# Altium schematic sheet oysm_Keyboard_Top.SchDoc: PCA70107 Top
size A4; DocumentNumber: 1; Revision: 0; SheetNumber: 1; SheetTotal: 4; ProjectNumber: <Project number>; DocumentSize: A4; PCBRevision: <PCB designer code>
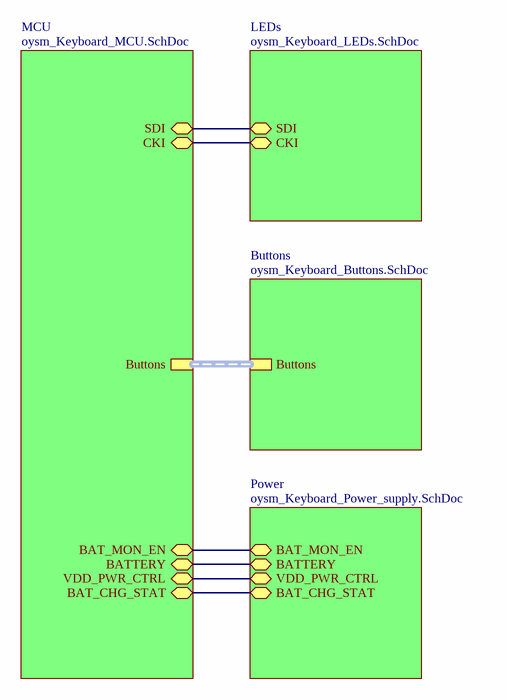
[diagram p0: oysm_Keyboard_Top.SchDoc]

## Sub-sheets
Buttons = oysm_Keyboard_Buttons.SchDoc: Buttons (harness Harness)
LEDs = oysm_Keyboard_LEDs.SchDoc: SDI (bidir), CKI (bidir)
MCU = oysm_Keyboard_MCU.SchDoc: Buttons (harness Harness), BATTERY (bidir), BAT_MON_EN (bidir), BAT_CHG_STAT (bidir), VDD_PWR_CTRL (bidir), SDI (bidir), CKI (bidir)
Power = oysm_Keyboard_Power_supply.SchDoc: BAT_MON_EN (bidir), BATTERY (bidir), VDD_PWR_CTRL (bidir), BAT_CHG_STAT (bidir)

## Nets
(unnamed): sheet MCU/BATTERY, sheet Power/BATTERY
(unnamed): sheet MCU/BAT_MON_EN, sheet Power/BAT_MON_EN
(unnamed): sheet MCU/BAT_CHG_STAT, sheet Power/BAT_CHG_STAT
(unnamed): sheet MCU/VDD_PWR_CTRL, sheet Power/VDD_PWR_CTRL
(unnamed): sheet MCU/SDI, sheet LEDs/SDI
(unnamed): sheet MCU/CKI, sheet LEDs/CKI

## Buses and harness runs
harness sheet Buttons/Buttons = sheet MCU/Buttons

## Notes on the sheet
- Title
- Size
- Date:
- Project Number
- Sheet         of
- Revision
- File:
- Drawn By: